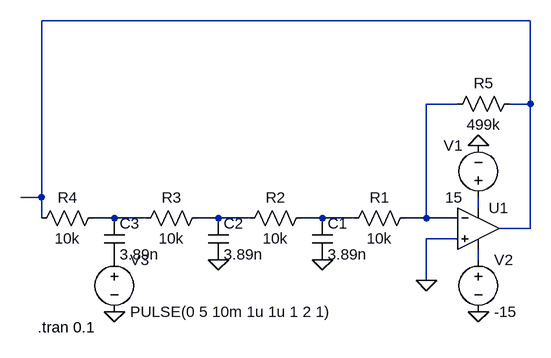
[diagram p0: schematic opamp_oscillator.asc]
opamp_oscillator.asc, the LTspice schematic file:
Version 4
SHEET 1 880 680
WIRE 368 -128 -384 -128
WIRE 256 0 208 0
WIRE 368 0 368 -128
WIRE 368 0 336 0
WIRE -384 144 -384 -128
WIRE -384 144 -416 144
WIRE 288 160 288 144
WIRE -384 176 -384 144
WIRE -272 176 -304 176
WIRE -224 176 -272 176
WIRE -112 176 -144 176
WIRE -64 176 -112 176
WIRE 48 176 16 176
WIRE 96 176 48 176
WIRE 208 176 208 0
WIRE 208 176 176 176
WIRE 256 176 208 176
WIRE 368 192 368 0
WIRE 368 192 320 192
WIRE 256 208 208 208
WIRE 288 240 288 224
WIRE 208 272 208 208
FLAG 208 272 0
FLAG 48 240 0
FLAG -112 240 0
FLAG 288 320 0
FLAG 288 64 0
FLAG -272 320 0
SYMBOL res 192 160 R90
WINDOW 0 0 56 VBottom 2
WINDOW 3 32 56 VTop 2
SYMATTR InstName R1
SYMATTR Value 10k
SYMBOL cap 32 176 R0
SYMATTR InstName C1
SYMATTR Value 3.89n
SYMBOL res 32 160 R90
WINDOW 0 0 56 VBottom 2
WINDOW 3 32 56 VTop 2
SYMATTR InstName R2
SYMATTR Value 10k
SYMBOL cap -128 176 R0
SYMATTR InstName C2
SYMATTR Value 3.89n
SYMBOL res -128 160 R90
WINDOW 0 0 56 VBottom 2
WINDOW 3 32 56 VTop 2
SYMATTR InstName R3
SYMATTR Value 10k
SYMBOL cap -288 176 R0
SYMATTR InstName C3
SYMATTR Value 3.89n
SYMBOL res -288 160 R90
WINDOW 0 0 56 VBottom 2
WINDOW 3 32 56 VTop 2
SYMATTR InstName R4
SYMATTR Value 10k
SYMBOL res 352 -16 R90
WINDOW 0 0 56 VBottom 2
WINDOW 3 32 56 VTop 2
SYMATTR InstName R5
SYMATTR Value 499k
SYMBOL voltage 288 160 R180
WINDOW 0 24 96 Left 2
WINDOW 3 24 16 Left 2
WINDOW 123 0 0 Left 0
WINDOW 39 0 0 Left 0
SYMATTR InstName V1
SYMATTR Value 15
SYMBOL voltage 288 224 R0
WINDOW 123 0 0 Left 0
WINDOW 39 0 0 Left 0
SYMATTR InstName V2
SYMATTR Value -15
SYMBOL voltage -272 224 R0
WINDOW 123 0 0 Left 0
WINDOW 39 0 0 Left 0
SYMATTR InstName V3
SYMATTR Value PULSE(0 5 10m 1u 1u 1 2 1)
SYMBOL OpAmps\\UniversalOpamp2 288 192 R0
SYMATTR InstName U1
TEXT -390 344 Left 2 !.tran 0.1

The netlist it stands for:
* opamp_oscillator.asc
R1 N002 N006 10k
C1 N006 0 3.89n
R2 N006 N005 10k
C2 N005 0 3.89n
R3 N005 N004 10k
C3 N004 P001 3.89n
R4 N004 N001 10k
R5 N001 N002 499k
V1 N003 0 15
V2 N007 0 -15
V3 P001 0 PULSE(0 5 10m 1u 1u 1 2 1)
XU1 0 N002 N003 N007 N001 level.2 Avol=1Meg GBW=10Meg Slew=10Meg ilimit=25m rail=0 Vos=0 phimargin=45 en=0 enk=0 in=0 ink=0 Rin=500Meg  ; pins IN+ IN- V+ V- OUT
.tran 0.1
.lib UniversalOpamps2.sub
.backanno
.end